# EAGLE design lisa_l_low_carrier (EAGLE 6.1)
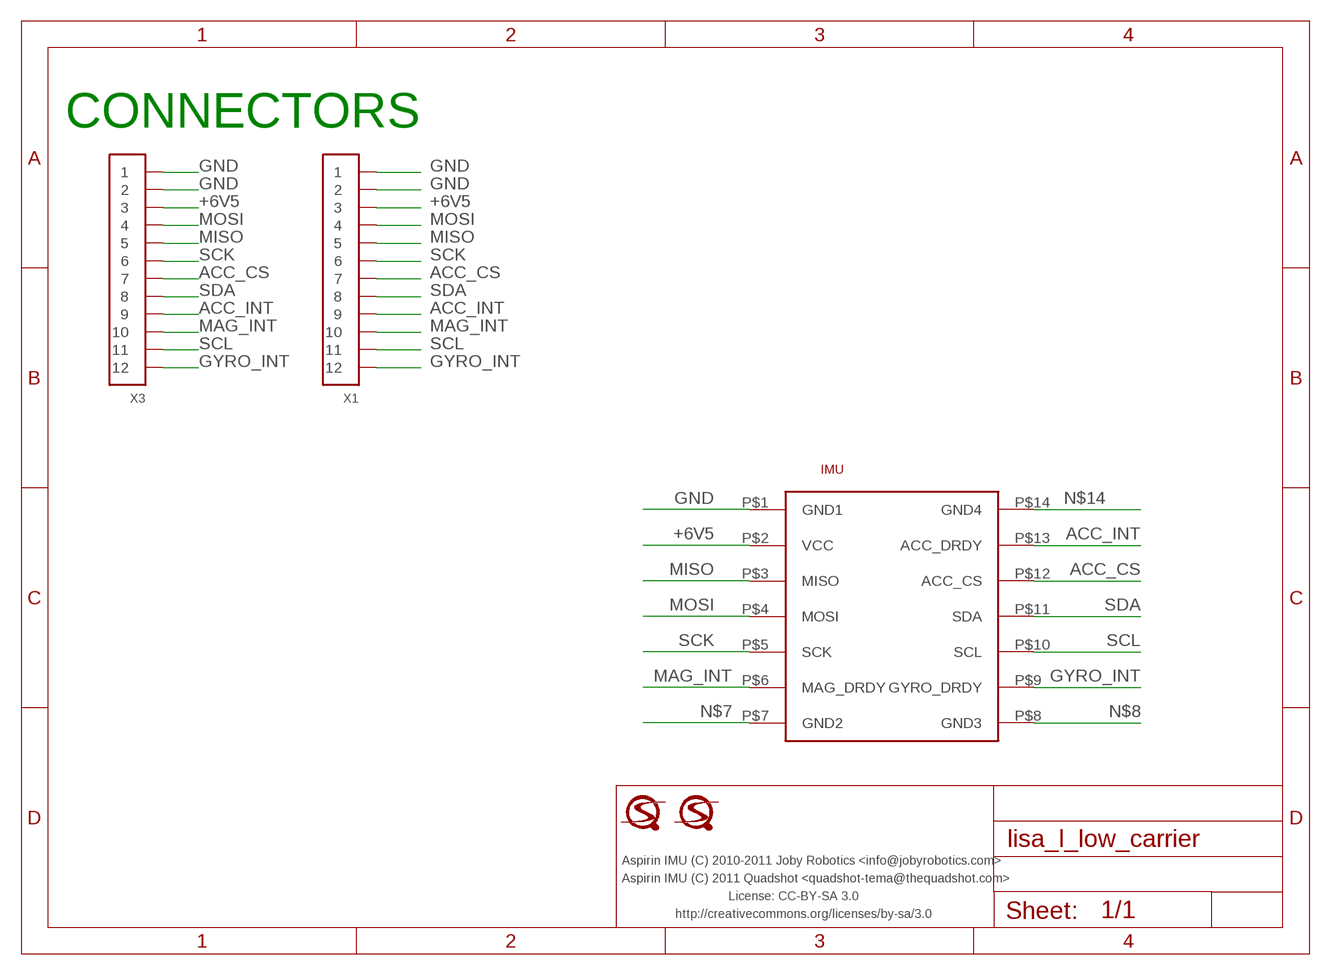
[diagram p0: schematic, sheet 1]

## Parts
IMU  ASPIRIN  [ASPIRIN_1]
U$1  LOGO  [LOGO]
U$2  LOGO  [LOGO]
X1  CONN_12-1-53261  [PB-53261-12]
X3  CONN_12-1-53047  [PB-53047-12]

## Nets
+6V5: IMU.P$2(VCC) X1.3 X3.3
ACC_CS: IMU.P$12(ACC_CS) X1.7 X3.7
ACC_INT: IMU.P$13(ACC_DRDY) X1.9 X3.9
GND: IMU.P$1(GND1) X1.1 X1.2 X3.1 X3.2
GYRO_INT: IMU.P$9(GYRO_DRDY) X1.12 X3.12
MAG_INT: IMU.P$6(MAG_DRDY) X1.10 X3.10
MISO: IMU.P$3(MISO) X1.5 X3.5
MOSI: IMU.P$4(MOSI) X1.4 X3.4
N$7: IMU.P$7(GND2)
N$8: IMU.P$8(GND3)
N$14: IMU.P$14(GND4)
SCK: IMU.P$5(SCK) X1.6 X3.6
SCL: IMU.P$10(SCL) X1.11 X3.11
SDA: IMU.P$11(SDA) X1.8 X3.8

## Notes on the sheet
- CONNECTORS
- Aspirin IMU (C) 2010-2011 Joby Robotics <info@jobyrobotics.com>
- Aspirin IMU (C) 2011 Quadshot <quadshot-tema@thequadshot.com>
- License: CC-BY-SA 3.0
- http://creativecommons.org/licenses/by-sa/3.0

## Library data of the parts
IMU = joby_robotics:ASPIRIN
U$1 U$2 = quadshot:LOGO
X1 X3 = pel_molex:CONN_12-1

## Board
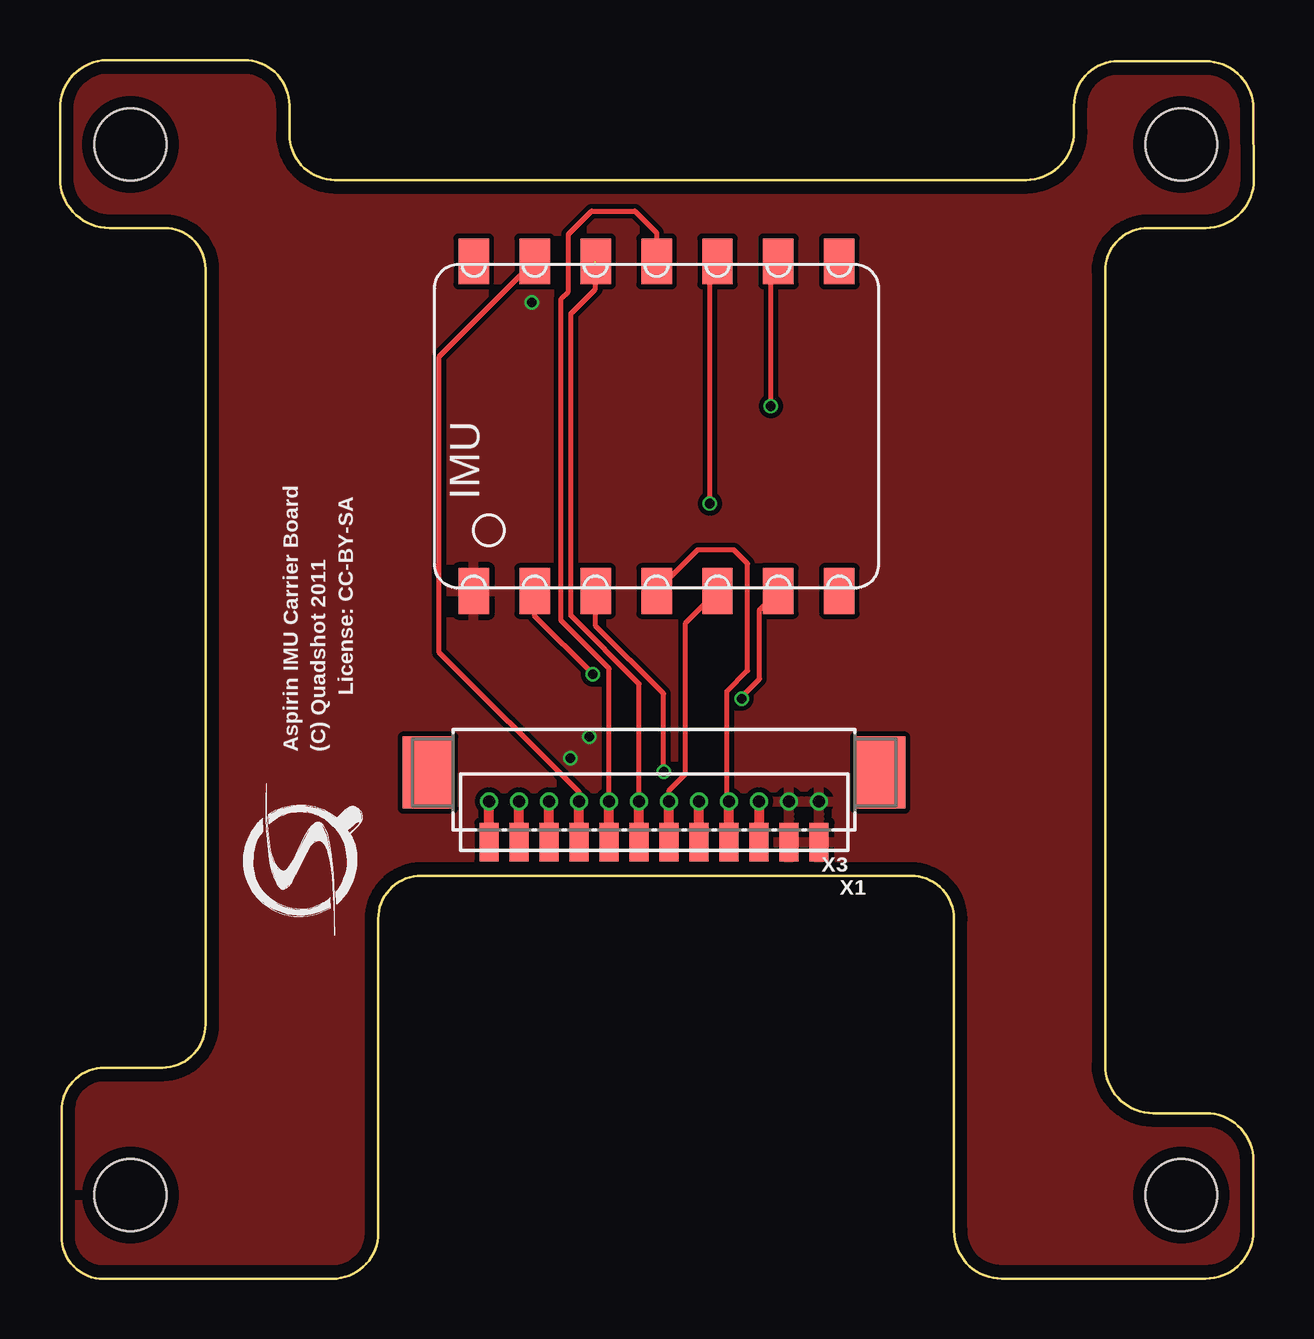
[diagram p1: board, top side]
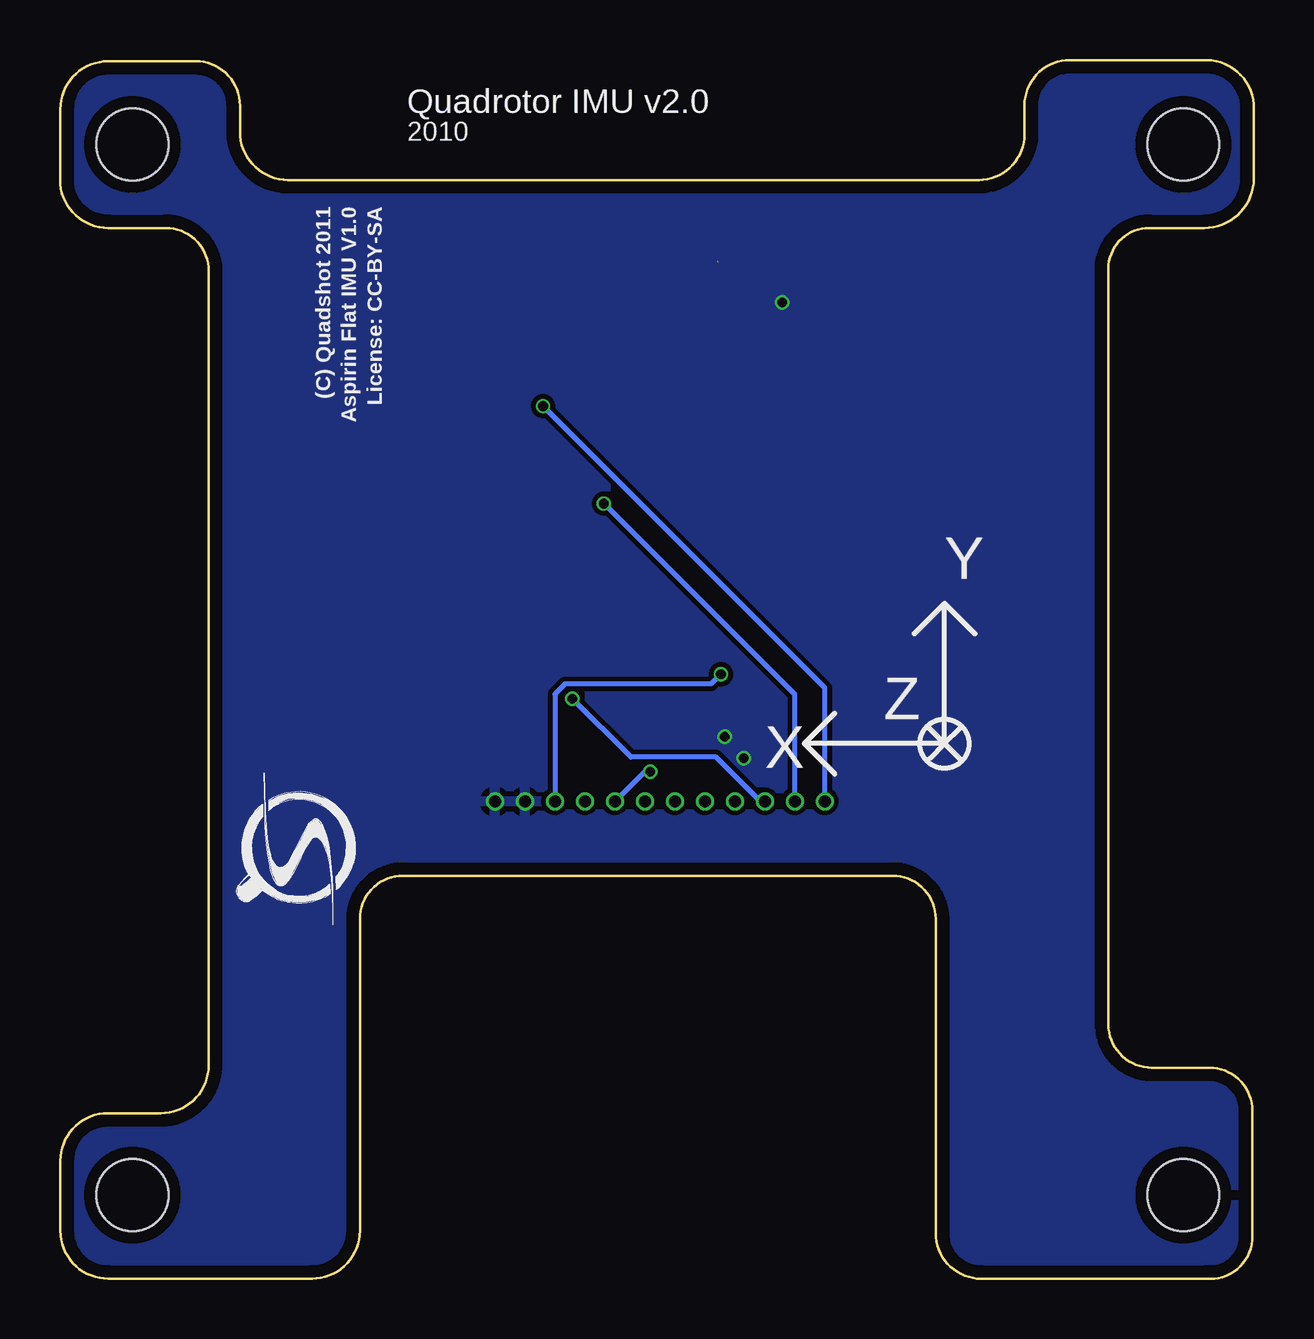
[diagram p2: board, bottom side, seen from below]

Size 49.76 x 50.81 mm. Coordinates in mm from the lower left corner, seen from the top.
Outline: 1.96,50.81 7.66,50.81 arc-90 9.56,48.91 9.56,47.71 arc90 11.46,45.81 40.26,45.81 arc90 42.26,47.81 42.26,48.91 arc-90 44.11,50.76 47.75,50.76 arc-90 49.75,48.76 49.76,45.81 arc-90 47.76,43.81 45.36,43.81 arc90 43.56,42.01 43.56,8.91 arc90 45.56,6.91 47.76,6.91 arc-90 49.75,4.92 49.75,2.01 arc-90 47.75,0.01 39.26,0.01 arc-90 37.26,2.01 37.26,15.01 arc90 35.46,16.81 15.06,16.81 arc90 13.26,15.01 13.26,1.91 arc-90 11.36,0.01 2,0.01 arc-90 0.06,1.61 0.06,7.01 arc-90 1.86,8.81 4.26,8.81 arc90 6.06,10.61 6.06,42.11 arc90 4.36,43.81 2.06,43.81 arc-90 0,45.87 0,48.76 arc-90 1.96,50.81
Copper layers (1*16): Top 0.035mm / dielectric 0.2mm / Bottom 0.035mm
Design rules: minimum track width 8mil, minimum drill 0.4mm, track to track 8mil, track to pad 8mil, pad to pad 8mil, via to via 8mil, smd to smd 8mil, copper to edge 20mil, drill to drill 8mil, minimum pad ring 0.1mm, minimum via ring 0.1mm, stop-mask expansion 4mil, vias tented up to drill 0mil, thermal gap 10mil
Holes 3 mm at 46.74,3.49 2.94,3.49 46.74,47.29 2.94,47.29

### Footprints (pad centres in the part's own frame; a part is rotated, then mirrored left to right if it is on the bottom)
ASPIRIN_1 = smd 1.905 x 1.27: P$1 -6.87,7.62; P$2 -6.87,5.08; P$3 -6.87,2.54; P$4 -6.87,0; P$5 -6.87,-2.54; P$6 -6.87,-5.08; P$7 -6.87,-7.62; P$8 6.87,-7.62; P$9 6.87,-5.08; P$10 6.87,-2.54; P$11 6.87,0; P$12 6.87,2.54; P$13 6.87,5.08; P$14 6.87,7.62
PB-53261-12 = smd 0.8 x 1.6: 1 -6.875,1.1; 2 -5.625,1.1; 3 -4.375,1.1; 4 -3.125,1.1; 5 -1.875,1.1; 6 -0.625,1.1; 7 0.625,1.1; 8 1.875,1.1; 9 3.125,1.1; 10 4.375,1.1; 11 5.625,1.1; 12 6.875,1.1 | smd 2.1 x 3: MNT1 -9.425,-1.8; MNT2 9.425,-1.8
PB-53047-12 = drill 0.5: 1 -6.875,0; 2 -5.625,0; 3 -4.375,0; 4 -3.125,0; 5 -1.875,0; 6 -0.625,0; 7 0.625,0; 8 1.875,0; 9 3.125,0; 10 4.375,0; 11 5.625,0; 12 6.875,0

### Placement (x,y rotation side)
IMU  24.87,35.54 90 top
U$1  39.76,17.91 270 bottom
U$2  9.96,17.51 90 top
X1  24.76,19.31 180 top
X3  24.76,19.91 180 top

### Tracks (layer width: path | path; a pad name or v marks a point on that pad's centre or on a via)
+6V5  (via drill 0.4)
  Top 0.203: IMU.P$2 19.79,27.63 v22.21,25.2
  Top 0.406: X3.3 X1.3
  Bottom 0.203: v22.21,25.2 22.62,24.8 28.71,24.8 29.14,24.37 X3.3
ACC_CS  (1 unrouted)
  Top 0.203: 22.31,42.37 22.31,41.26 21.3,40.24 21.3,27.64 24.14,24.8 X3.7
  Top 0.406: X1.7 X3.7
ACC_INT
  Top 0.203: IMU.P$13 15.81,38.44 15.81,26.12 21.64,20.29 X3.9
  Top 0.406: X1.9 X3.9
GND  (via drill 0.4)
  other vias: 21.26,21.71 22.06,22.61 19.66,40.71
  pour Top (rank 6): 0,0.03 49.71,0.03 49.71,50.76 0,50.76
  pour Bottom: 0.08,50.76 49.71,50.76 49.71,0.08 0.08,0.08
GYRO_INT  (via drill 0.4)
  Top 0.203: IMU.P$9 29.63,42.09 v29.63,36.38
  Top 0.406: X1.12 X3.12
  Bottom 0.203: v29.63,36.38 17.89,24.64 X3.12
MAG_INT  (via drill 0.4)
  Top 0.203: IMU.P$6 29.16,27.89 29.16,25.01 28.41,24.25 v28.41,24.19
  Top 0.406: X1.10 X3.10
  Bottom 0.203: v28.41,24.19 25.97,21.75 22.42,21.75 20.57,19.91 X3.10
MISO  (via drill 0.4)
  Top 0.203: v25.16,21.14 25.16,24.39 22.33,27.22 IMU.P$3
  Top 0.406: X1.5 X3.5
  Bottom 0.203: v25.16,21.14 25.41,21.14 X3.5
MOSI
  Top 0.203: IMU.P$4 26.58,30.39 28.09,30.39 28.66,29.81 28.66,25.36 27.8,24.49 27.8,20 X3.4
  Top 0.406: X1.4 X3.4
SCK
  Top 0.203: IMU.P$5 26.07,27.34 26.07,21.04 25.39,20.35 X3.6
  Top 0.406: X1.6 X3.6
SCL  (via drill 0.4)
  Top 0.203: IMU.P$10 27.09,42.09 v27.09,32.32
  Top 0.406: X1.11 X3.11
  Bottom 0.203: v27.09,32.32 19.14,24.37 X3.11
SDA
  Top 0.203: IMU.P$11 24.87,43.6 23.96,44.51 22.16,44.51 21.2,43.54 21.2,41.16 20.89,40.85 20.89,27.44 22.89,25.44 X3.8
  Top 0.406: X1.8 X3.8

### Text on the board
tPlace: License: CC-BY-SA | Aspirin IMU Carrier Board | (C) Quadshot 2011
bPlace: License: CC-BY-SA | Aspirin Flat IMU V1.0 | (C) Quadshot 2011
bNames: Quadrotor IMU v2.0 | 2010 | Y | Z | X